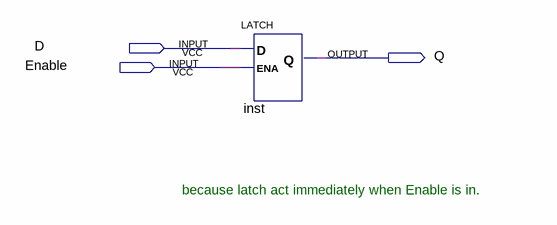
[diagram p0: schematic sheet]
// Quartus schematic week4_1_latch.bdf as structural Verilog: 1 symbols, 3 pins
module week4_1_latch (
  input  D,
  input  Enable,
  output Q
);

  LATCH inst (.D(D), .ENA(Enable), .Q(Q));

  // Notes on the sheet:
  //   because latch act immediately when Enable is in.
endmodule
